# EAGLE design G888X (EAGLE 6.6.0)
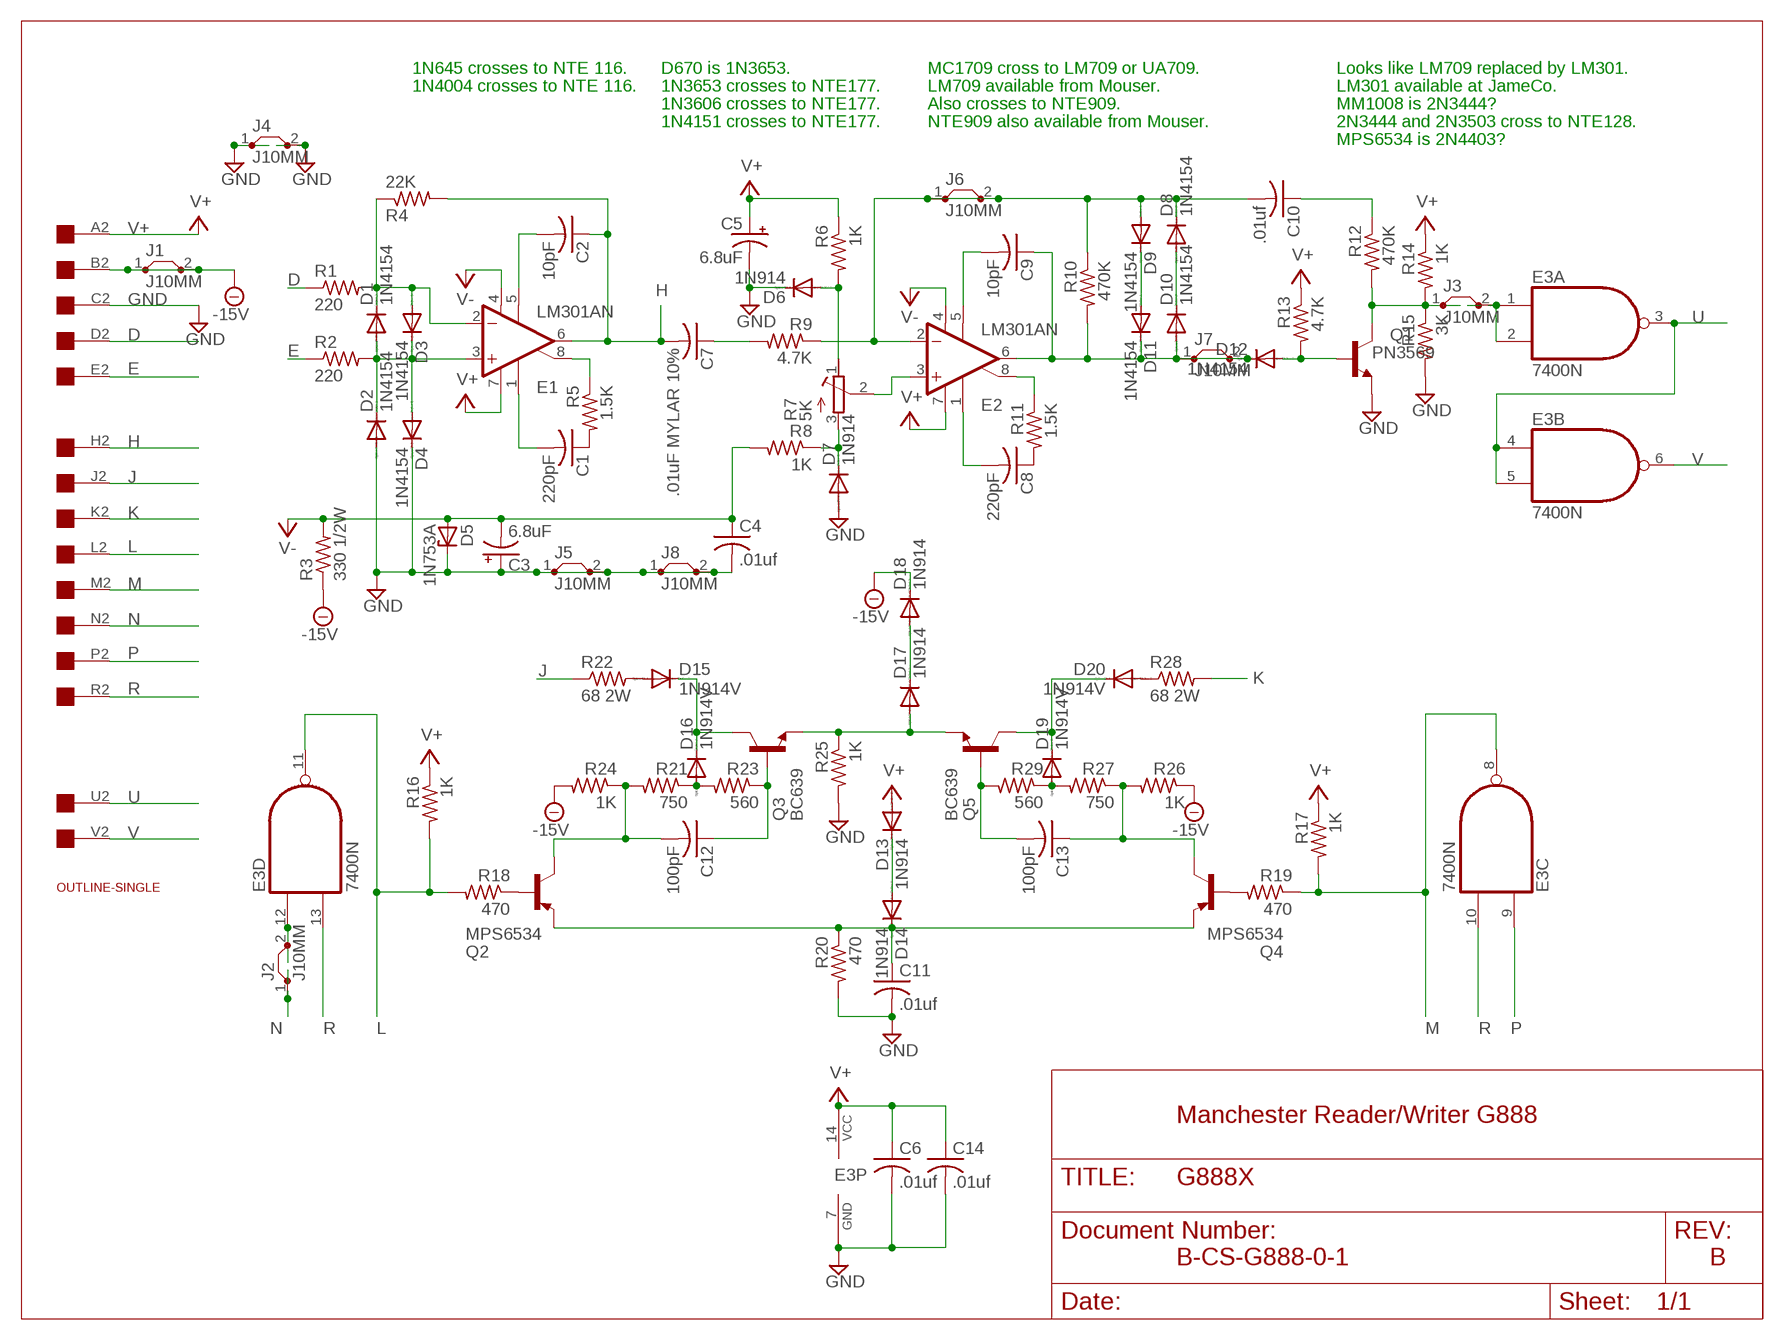
[diagram p0: schematic, sheet 1]

## Parts
C1  220pF  C-US050-025X075  [C050-025X075]
C2  10pF  C-US050-025X075  [C050-025X075]
C3  6.8uF  CPOL-USE20-8AXIAL  [E12-8]
C4  .01uf  C-US050-025X075  [C050-025X075]
C5  6.8uF  CPOL-USE20-8AXIAL  [E12-8]
C6  .01uf  C-US050-025X075  [C050-025X075]
C7  .01uF MYLAR 10%  C-US225-062X268  [C225-062X268]
C8  220pF  C-US050-025X075  [C050-025X075]
C9  10pF  C-US050-025X075  [C050-025X075]
C10  .01uf  C-US050-025X075  [C050-025X075]
C11  .01uf  C-US050-025X075  [C050-025X075]
C12  100pF  C-US050-025X075  [C050-025X075]
C13  100pF  C-US050-025X075  [C050-025X075]
C14  .01uf  C-US050-025X075  [C050-025X075]
D1  1N4154  DIODE-DO35-10  [DO35-10]
D2  1N4154  DIODE-DO35-10  [DO35-10]
D3  1N4154  DIODE-DO35-10  [DO35-10]
D4  1N4154  DIODE-DO35-10  [DO35-10]
D5  1N753A  ZENER-DIODEDO35Z10  [DO35Z10]
D6  1N914  DIODE-DO35-10  [DO35-10]
D7  1N914  DIODE-DO35-10  [DO35-10]
D8  1N4154  DIODE-DO35-10  [DO35-10]
D9  1N4154  DIODE-DO35-10  [DO35-10]
D10  1N4154  DIODE-DO35-10  [DO35-10]
D11  1N4154  DIODE-DO35-10  [DO35-10]
D12  1N4154  DIODE-DO35-10  [DO35-10]
D13  1N914  DIODE-DO35-10  [DO35-10]
D14  1N914  DIODE-DO35-10  [DO35-10]
D15  1N914V  DIODE-DO35-10  [DO35-10]
D16  1N914V  DIODE-DO35-10  [DO35-10]
D17  1N914  DIODE-DO35-10  [DO35-10]
D18  1N914  DIODE-DO35-10  [DO35-10]
D19  1N914V  DIODE-DO35-10  [DO35-10]
D20  1N914V  DIODE-DO35-10  [DO35-10]
E1  LM301AN  MC1709N  [DIL08]
E2  LM301AN  MC1709N  [DIL08]
E3  7400N  [DIL14]
J1  J10MM  [10]
J2  J10MM  [10]
J3  J10MM  [10]
J4  J10MM  [10]
J5  J10MM  [10]
J6  J10MM  [10]
J7  J10MM  [10]
J8  J10MM  [10]
Q1  PN3569  2N1711  [TO39]
Q2  MPS6534  2N5415  [TO39]
Q3  BC639  2N1711  [TO39]
Q4  MPS6534  2N5415  [TO39]
Q5  BC639  2N1711  [TO39]
R1  220  R-US_0207/10  [0207/10]
R2  220  R-US_0207/10  [0207/10]
R3  330 1/2W  R-US_0411/15  [0411/15]
R4  22K  R-US_0207/10  [0207/10]
R5  1.5K  R-US_0207/10  [0207/10]
R6  1K  R-US_0207/10  [0207/10]
R7  5K  275P  [3006Y]
R8  1K  R-US_0207/10  [0207/10]
R9  4.7K  R-US_0207/10  [0207/10]
R10  470K  R-US_0207/10  [0207/10]
R11  1.5K  R-US_0207/10  [0207/10]
R12  470K  R-US_0207/10  [0207/10]
R13  4.7K  R-US_0207/10  [0207/10]
R14  1K  R-US_0207/10  [0207/10]
R15  3K  R-US_0207/10  [0207/10]
R16  1K  R-US_0207/10  [0207/10]
R17  1K  R-US_0207/10  [0207/10]
R18  470  R-US_0207/10  [0207/10]
R19  470  R-US_0207/10  [0207/10]
R20  470  R-US_0207/10  [0207/10]
R21  750  R-US_0207/10  [0207/10]
R22  68 2W  R-US_0817/22  [P0817/22]
R23  560  R-US_0207/10  [0207/10]
R24  1K  R-US_0207/10  [0207/10]
R25  1K  R-US_0207/10  [0207/10]
R26  1K  R-US_0207/10  [0207/10]
R27  750  R-US_0207/10  [0207/10]
R28  68 2W  R-US_0817/22  [P0817/22]
R29  560  R-US_0207/10  [0207/10]
U$1  EDGE-1  [EDGE-CON1]
U$4  OUTLINE-SINGLE  [SINGLE]

## Nets
-15V [Supply]: D18.C J1.1 J1.2 R3.1 R24.2 R26.1 U$1.B2
D: R1.1 U$1.D2
E: R2.1 U$1.E2
GND [Supply]: C3.+ C4.2 C5.- C6.2 C11.2 C14.2 D2.A D4.C D5.C D6.C D7.A E3.7(P:GND) J4.1 J4.2 J5.1 J5.2 J8.1 J8.2 Q1.1(E) R15.2 R20.2 R25.2 U$1.C2
H: C2.1 C7.2 E1.6(OUT) R4.2 U$1.H2
J: R22.1 U$1.J2
K: R28.2 U$1.K2
L: E3.11(D:O) R16.2 R18.2 U$1.L2
M: E3.8(C:O) R17.2 R19.1 U$1.M2
N: E3.12(D:I0) J2.1 J2.2 U$1.N2
N$1: C1.1 R5.2
N$2: C8.1 R11.2
N$3: D1.C D3.A E1.2(-IN) R1.2 R4.1
N$4: D1.A D2.C D3.C D4.A E1.3(+IN) R2.2
N$5: C8.2 E2.1(ON1)
N$6: C1.2 E1.1(ON1)
N$7: E1.8(ON2) R5.1
N$8: C2.2 E1.5(OPT)
N$9: D6.A R6.2 R7.1(A)
N$10: C10.2 D8.C D9.A E2.2(-IN) J6.1 J6.2 R9.1 R10.1
N$11: E2.3(+IN) R7.2(S)
N$12: D7.C R7.3(E) R8.1
N$13: E2.8(ON2) R11.1
N$14: C9.2 E2.5(OPT)
N$15: C9.1 D10.A D11.C D12.C E2.6(OUT) J7.1 J7.2 R10.2
N$16: C7.1 R9.2
N$17: D9.C D11.A
N$18: D8.A D10.C
N$19: C10.1 R12.1
N$20: D12.A Q1.2(B) R13.2
N$21: E3.1(A:I0) E3.2(A:I1) J3.1 J3.2 Q1.3(C) R12.2 R14.2 R15.1
N$22: D17.A Q3.1(E) Q5.1(E) R25.1
N$23: C11.1 D14.C Q2.1(E) Q4.1(E) R20.1
N$24: D13.C D14.A
N$25: Q2.2(B) R18.1
N$26: Q4.2(B) R19.2
N$27: D15.A R22.2
N$28: D16.A R21.1 R23.2
N$29: C12.2 Q2.3(C) R21.2 R24.1
N$30: C12.1 Q3.2(B) R23.1
N$31: D19.A R27.2 R29.1
N$32: C13.1 Q4.3(C) R26.2 R27.1
N$33: C13.2 Q5.2(B) R29.2
N$34: D20.A R28.1
N$35: D15.C D16.C Q3.3(C)
N$36: D19.C D20.C Q5.3(C)
N$37: D17.C D18.A
P: E3.9(C:I0) U$1.P2
R: E3.10(C:I1) E3.13(D:I1) U$1.R2
U: E3.3(A:O) E3.4(B:I0) E3.5(B:I1) U$1.U2
V: E3.6(B:O) U$1.V2
V+ [Supply]: C5.+ C6.1 C14.1 D13.A E1.7(V+) E2.7(V+) E3.14(P:VCC) R6.1 R13.1 R14.1 R16.1 R17.1 U$1.A2
V-: C3.- C4.1 D5.A E1.4(V-) E2.4(V-) R3.2 R8.2
Unconnected: U$1.F2 U$1.S2 U$1.T2

## Notes on the sheet
- 1N645 crosses to NTE 116. | D670 is 1N3653. | MC1709 cross to LM709 or UA709. | Looks like LM709 replaced by LM301.
- 1N4004 crosses to NTE 116. | 1N3653 crosses to NTE177. | LM709 available from Mouser. | LM301 available at JameCo.
- 1N3606 crosses to NTE177. | Also crosses to NTE909. | MM1008 is 2N3444?
- 1N4151 crosses to NTE177. | NTE909 also available from Mouser. | 2N3444 and 2N3503 cross to NTE128.
- MPS6534 is 2N4403?
- Manchester Reader/Writer G888
- B-CS-G888-0-1 | B

## Library data of the parts
C1 C2 C4 C6-C14 = rcl:C-US: CAPACITOR, American symbol
C3 C5 = dec-con:CPOL-USE20-8AXIAL: A 0.8 inch electrolytic.
D1-D4 D6-D20 = diode:DIODE-: DIODE
D5 = diode:ZENER-DIODE: Z-Diode
E1 E2 = dec-con:MC1709: OP AMP
E3 = 74xx-us:74*00: Quad 2-input NAND gate
J1-J8 = jumper:J: Bridge
Q1 Q3 Q5 = transistor-npn:2N1711: NPN Transistor
Q2 Q4 = transistor-pnp:2N5415*: PNP Transistror
R1-R6 R8-R29 = rcl:R-US_: RESISTOR, American symbol
R7 = dec-con:275P: Trimpot with 275P (3006Y) footprint.
U$1 = dec-con:EDGE-1: Single-Sided DEC Edge Connector -- (side 2)
U$4 = dec-con:OUTLINE-*: Board outlines for DEC boards.

## Net classes
1 Supply: width 0.813 mm

## Board
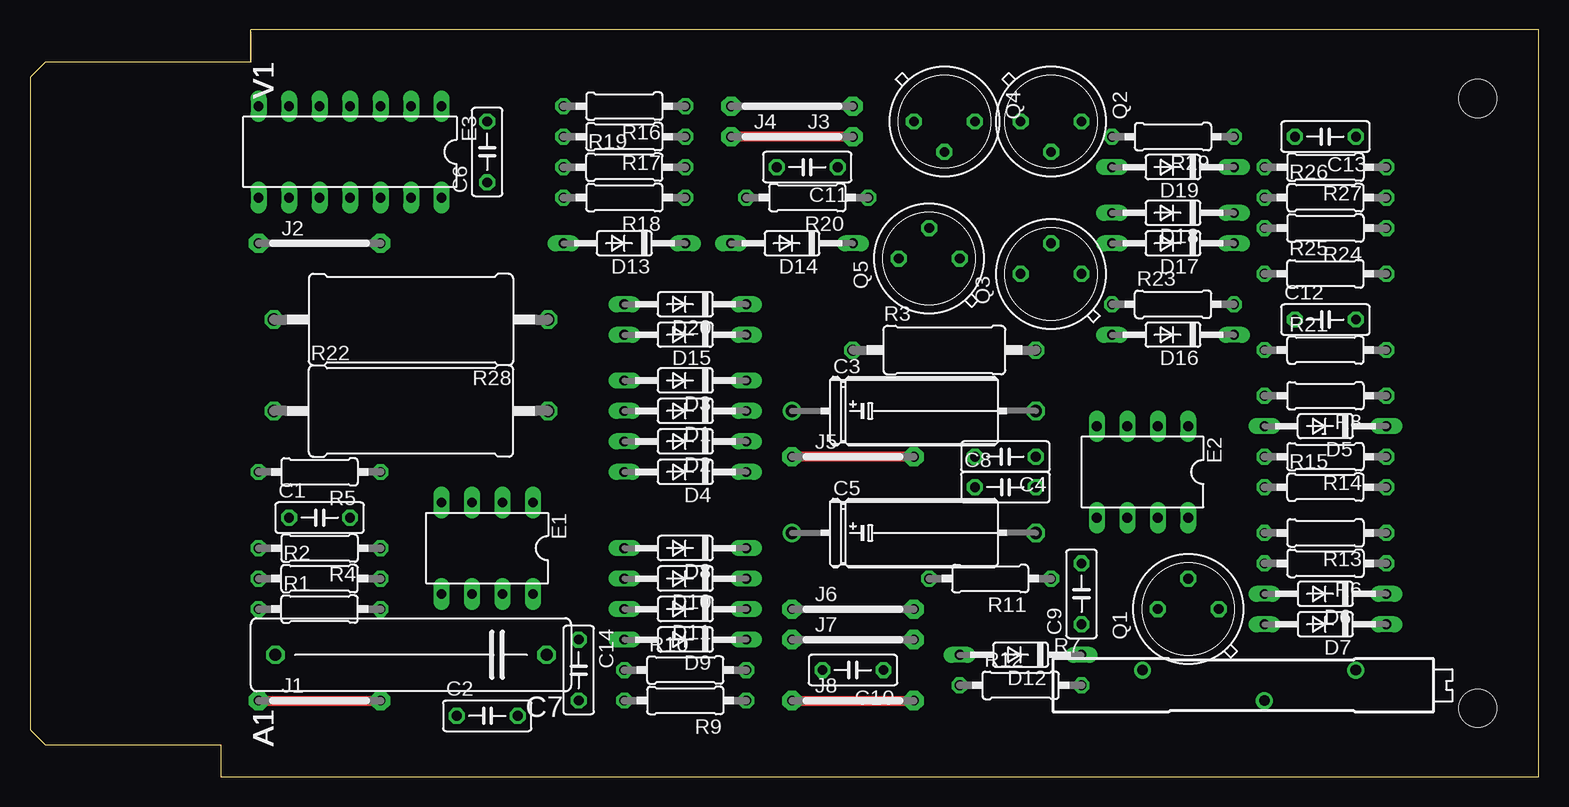
[diagram p1: board, top side]
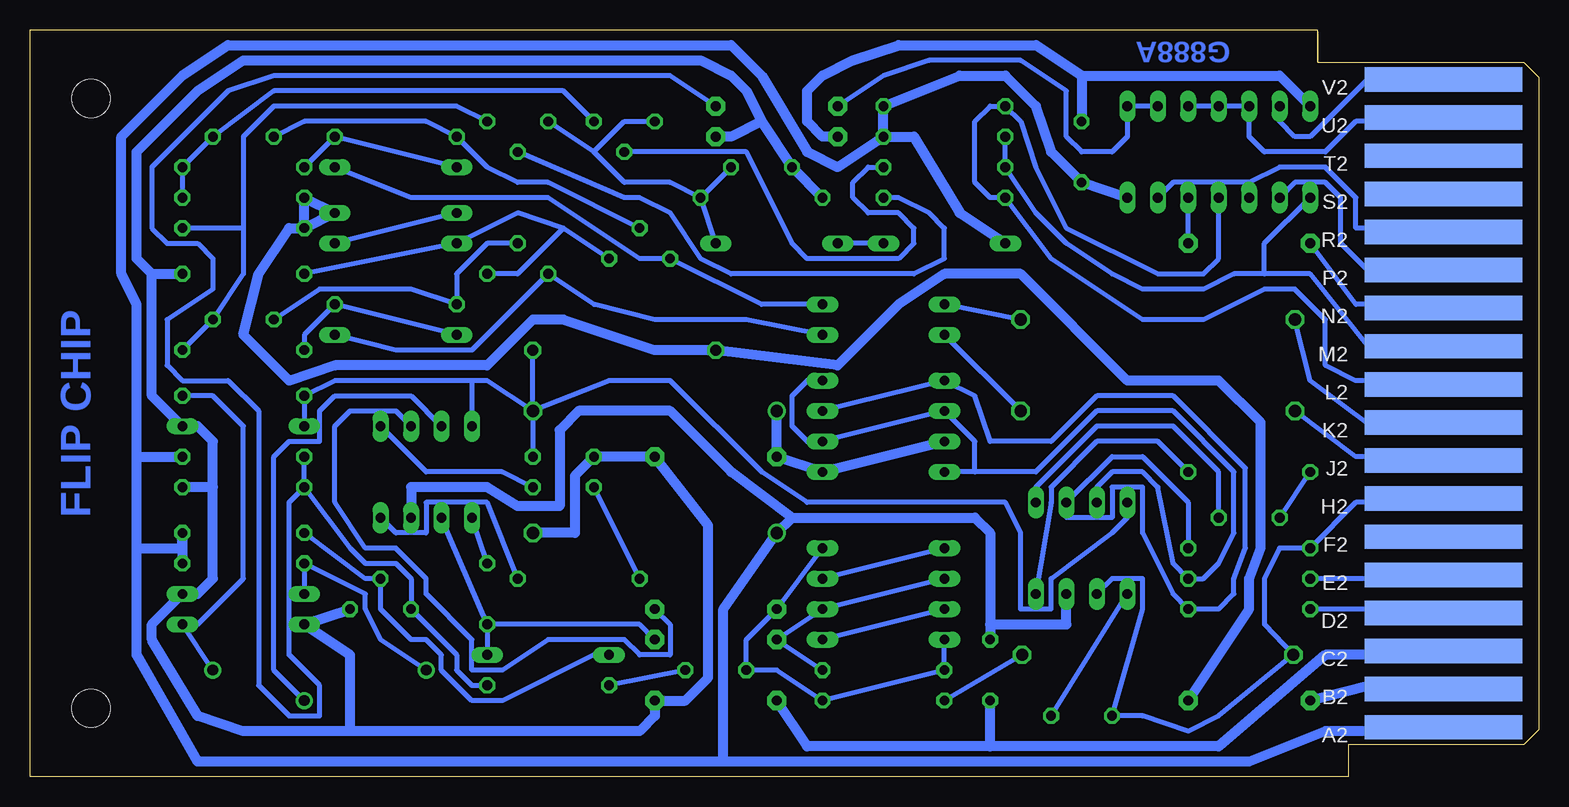
[diagram p2: board, bottom side, seen from below]

Size 125.73 x 62.23 mm. Coordinates in mm from the lower left corner, seen from the top.
Copper layers (1+16): Top 0.035mm / dielectric 1.5mm / Bottom 0.035mm
Design rules "16mils": minimum track width 16mil, minimum drill 32mil, track to track 15mil, track to pad 10mil, pad to pad 10mil, via to via 10mil, smd to smd 10mil, copper to edge 13mil, drill to drill 10mil, minimum pad ring 10mil, minimum via ring 8mil, stop-mask expansion 0mil, vias tented up to drill 0mil, thermal gap 10mil

### Footprints (pad centres in the part's own frame; a part is rotated, then mirrored left to right if it is on the bottom)
C050-025X075 = drill 0.813 octagon: 1 -2.54,0; 2 2.54,0
E12-8 = drill 1.016: + -10.16,0 | drill 1.016 octagon: - 10.16,0
C225-062X268 = drill 1.016 octagon: 1 -11.303,0; 2 11.303,0
DO35-10 = drill 0.813 long: A 5.08,0; C -5.08,0
DO35Z10 = drill 0.813 long: A 5.08,0; C -5.08,0
DIL08 = drill 0.813 long: 1 -3.81,-3.81; 2 -1.27,-3.81; 3 1.27,-3.81; 4 3.81,-3.81; 5 3.81,3.81; 6 1.27,3.81; 7 -1.27,3.81; 8 -3.81,3.81
DIL14 = drill 0.813 long: 1 -7.62,-3.81; 2 -5.08,-3.81; 3 -2.54,-3.81; 4 0,-3.81; 5 2.54,-3.81; 6 5.08,-3.81; 7 7.62,-3.81; 8 7.62,3.81; 9 5.08,3.81; 10 2.54,3.81; 11 0,3.81; 12 -2.54,3.81; 13 -5.08,3.81; 14 -7.62,3.81
10 = drill 0.813 pad 1.6 octagon: 1 -5.08,0; 2 5.08,0
TO39 = drill 0.813 octagon: 1 0,-2.54; 2 2.54,0; 3 0,2.54
0207/10 = drill 0.813 octagon: 1 -5.08,0; 2 5.08,0
0411/15 = drill 0.914 octagon: 1 -7.62,0; 2 7.62,0
3006Y = drill 0.9: 1 -8.89,1.27; 2 1.27,-1.27; 3 8.89,1.27
P0817/22 = drill 1.016 octagon: 1 -11.43,0; 2 11.43,0
EDGE-CON1 = smd 13.106 x 2.032 bottom: A2 7.938,4.128; B2 7.938,7.303; C2 7.938,10.477; D2 7.938,13.652; E2 7.938,16.828; F2 7.938,20.003; H2 7.938,23.177; J2 7.938,26.352; K2 7.938,29.527; L2 7.938,32.703; M2 7.938,35.877; N2 7.938,39.053; P2 7.938,42.227; R2 7.938,45.403; S2 7.938,48.578; T2 7.938,51.752; U2 7.938,54.928; V2 7.938,58.102
SINGLE = hole 3.175: 120.65,56.515; 120.65,5.715

### Placement (x,y rotation side)
C1  24.13,21.59 0 top
C2  38.1,5.08 0 top
C3  73.66,30.48 0 top
C4  81.28,26.67 180 top
C5  73.66,20.32 0 top
C6  38.1,52.07 90 top
C7  31.75,10.16 180 top
C8  81.28,24.13 0 top
C9  87.63,15.24 90 top
C10  68.58,8.89 180 top
C11  64.77,50.8 180 top
C12  107.95,38.1 0 top
C13  107.95,53.34 180 top
C14  45.72,8.89 270 top
D1  54.61,30.48 180 top
D2  54.61,27.94 180 top
D3  54.61,33.02 180 top
D4  54.61,25.4 180 top
D5  107.95,29.21 180 top
D6  107.95,15.24 180 top
D7  107.95,12.7 180 top
D8  54.61,19.05 180 top
D9  54.61,11.43 180 top
D10  54.61,16.51 180 top
D11  54.61,13.97 180 top
D12  82.55,10.16 180 top
D13  49.53,44.45 180 top
D14  63.5,44.45 180 top
D15  54.61,36.83 180 top
D16  95.25,36.83 180 top
D17  95.25,44.45 180 top
D18  95.25,46.99 180 top
D19  95.25,50.8 180 top
D20  54.61,39.37 180 top
E1  38.1,19.05 180 top
E2  92.71,25.4 180 top
E3  26.67,52.07 180 top
J1  24.13,6.35 0 top
J2  24.13,44.45 0 top
J3  63.5,55.88 180 top
J4  63.5,53.34 0 top
J5  68.58,26.67 0 top
J6  68.58,13.97 0 top
J7  68.58,11.43 0 top
J8  68.58,6.35 0 top
Q1  96.52,13.97 90 top
Q2  85.09,54.61 270 top
Q3  85.09,41.91 90 top
Q4  76.2,54.61 270 top
Q5  74.93,43.18 90 top
R1  24.13,13.97 0 top
R2  24.13,16.51 0 top
R3  76.2,35.56 0 top
R4  24.13,19.05 180 top
R5  24.13,25.4 180 top
R6  107.95,17.78 180 top
R7  101.6,7.62 0 top
R8  107.95,31.75 180 top
R9  54.61,6.35 180 top
R10  54.61,8.89 0 top
R11  80.01,16.51 180 top
R12  82.55,7.62 0 top
R13  107.95,20.32 180 top
R14  107.95,26.67 180 top
R15  107.95,24.13 0 top
R16  49.53,55.88 180 top
R17  49.53,53.34 180 top
R18  49.53,48.26 180 top
R19  49.53,50.8 0 top
R20  64.77,48.26 180 top
R21  107.95,35.56 0 top
R22  31.75,30.48 0 top
R23  95.25,39.37 0 top
R24  107.95,45.72 180 top
R25  107.95,41.91 0 top
R26  107.95,48.26 0 top
R27  107.95,50.8 180 top
R28  31.75,38.1 180 top
R29  95.25,53.34 180 top
U$1  0,0 0 top
U$4  0,0 0 top

### Tracks (layer width: path | path; a pad name or v marks a point on that pad's centre or on a via)
-15V
  Top 0.813: J1.1 J1.2
  Bottom 0.813: R24.2 R26.1 D18.C R24.2 | R24.2 104.14,45.72 106.68,41.91 107.95,36.83 104.14,33.02 100.33,34.29 87.63,34.29 83.82,38.1 81.28,38.1 73.66,35.56 R3.1 58.42,34.29 53.34,39.37 49.53,41.91 43.18,41.91 34.29,33.02 26.67,33.02 23.18,29.53 23.18,19.05 24.13,16.51 24.13,13.97 J1.2 | U$1.B2 8.89,7.62 13.97,7.62 J1.1
D
  Bottom 0.406: U$1.D2 8.89,13.97 R1.1
E
  Bottom 0.406: U$1.E2 8.89,16.51 R2.1
GND
  Top 0.813: J4.2 J4.1 | J5.2 J5.1 | J8.1 J8.2
  Bottom 0.813: U$1.C2 8.89,10.16 17.78,10.16 26.67,2.54 45.72,2.54 | 45.72,2.54 60.96,2.54 J8.1 | 99.06,3.81 74.93,3.81 73.66,5.08 J8.2 71.12,6.35 69.22,8.26 69.22,20.95 J5.2 C4.2 80.33,25.08 80.33,20.32 C5.- | 99.06,3.81 107.95,3.81 111.76,5.08 115.57,11.43 115.57,12.7 D6.C 111.76,15.24 110.49,16.51 110.49,24.13 | D2.A D4.C J5.1 C3.+ | E3.7 21.59,58.42 38.1,58.42 | 38.1,58.42 C6.2 | 38.1,58.42 41.91,60.96 53.34,60.96 57.15,59.69 59.69,58.42 60.96,57.15 60.96,54.61 59.69,53.34 J4.1 | R20.2 C11.2 64.77,54.61 | 64.77,54.61 67.31,53.34 J4.2 | 64.77,54.61 66.04,57.15 67.31,58.42 69.85,59.69 107.95,59.69 111.76,57.15 116.84,52.07 116.84,43.18 115.57,41.91 | 45.72,2.54 C14.2 | 110.49,24.13 R15.2 | 110.49,24.13 110.49,27.94 111.76,29.21 D5.C 115.57,31.75 115.57,41.91 | 115.57,41.91 R25.2 | Q1.1 D7.A 99.06,10.16 99.06,3.81
H
  Bottom 0.406: U$1.H2 8.89,22.86 15.24,22.86 R4.2 21.59,19.05 22.86,16.51 22.86,12.7 C7.2 26.67,5.08 29.21,3.81 33.02,5.08 C2.1 33.02,13.97 33.02,16.51 35.56,16.51 E1.6
J
  Bottom 0.406: U$1.J2 8.89,26.67 15.24,26.67 R22.1
K
  Bottom 0.406: U$1.K2 8.89,29.21 13.97,29.21 19.05,33.02 R28.2
L
  Bottom 0.406: E3.11 26.67,43.18 27.94,41.91 31.75,41.91 39.37,45.72 41.91,50.8 43.18,54.61 R16.2 45.72,55.88 46.99,54.61 46.99,49.53 45.72,48.26 R18.2 40.64,43.18 33.02,38.1 27.94,38.1 22.86,40.64 20.32,40.64 17.78,38.1 17.78,34.29 15.24,33.02 8.89,33.02 U$1.L2
M
  Bottom 0.406: U$1.M2 8.89,35.56 13.97,35.56 19.05,41.91 22.86,41.91 | 22.86,41.91 22.86,44.45 E3.8 | R17.2 R19.1 41.91,46.99 39.37,44.45 35.56,41.91 33.02,40.64 27.94,40.64 25.4,41.91 22.86,41.91
N
  Top 0.406: J2.1 J2.2
  Bottom 0.406: U$1.N2 8.89,39.37 15.24,39.37 J2.1 | J2.2 E3.12
N$1
  Bottom 0.406: C1.1 R5.2
N$2
  Bottom 0.406: R11.2 C8.1
N$3
  Bottom 0.406: D1.C D3.A 46.99,31.75 45.72,27.94 40.64,27.94 36.83,31.75 30.48,31.75 24.45,25.72 24.45,19.05 25.4,16.51 25.4,15.24 26.67,13.97 R1.2 30.48,15.24 33.02,20.32 33.02,24.13 35.56,24.13 35.56,21.59 39.37,21.59 E1.2 35.56,26.67 33.02,26.67 29.21,22.86 R4.1
N$4
  Bottom 0.406: D3.C 60.96,33.02 62.23,31.75 62.23,29.21 60.96,27.94 D2.C D1.A 46.99,27.94 46.99,25.4 | 46.99,25.4 D4.A | E1.3 36.83,24.13 35.56,25.4 33.02,25.4 31.75,24.13 30.48,17.78 R2.2 27.94,16.51 26.67,17.78 25.4,20.32 25.4,25.4 30.48,30.48 36.83,30.48 41.91,25.4 46.99,25.4
N$5
  Bottom 0.406: C8.2 86.36,25.4 92.71,25.4 E2.1
N$6
  Bottom 0.406: C1.2 26.67,25.4 30.48,29.21 36.83,29.21 41.91,24.13 E1.1
N$7
  Bottom 0.406: R5.1 31.75,27.94 36.83,27.94 40.64,24.13 40.64,22.86 E1.8
N$8
  Bottom 0.406: C2.2 E1.5
N$9
  Bottom 0.406: R7.1 96.52,11.43 97.79,13.97 97.79,15.24 R6.2 D6.A
N$10
  Top 0.406: J6.1 J6.2
  Bottom 0.406: D8.C J6.1 66.04,11.43 C10.2 63.5,8.89 R9.1 R10.1 D9.A | E2.2 95.25,30.48 99.06,30.48 100.33,29.21 100.33,22.86 97.79,19.05 95.25,19.05 92.71,16.51 92.71,15.24 88.9,11.43 88.9,8.89 86.36,8.89 82.55,11.43 76.2,11.43 74.93,10.16 72.39,10.16 72.39,12.7 J6.2
N$11
  Bottom 0.406: R7.2 105.41,8.89 105.41,26.67 104.14,27.94 101.6,27.94 101.6,30.48 100.33,31.75 93.98,31.75 E2.3
N$12
  Bottom 0.406: R7.3 D7.C 111.76,12.7 107.95,16.51 107.95,29.21 110.49,31.75 R8.1
N$13
  Bottom 0.406: R11.1 87.63,22.86 92.71,22.86 92.71,20.32 95.25,20.32 E2.8
N$14
  Bottom 0.406: C9.2 E2.5
N$15
  Top 0.406: J7.1 J7.2
  Bottom 0.406: R10.2 J7.1 D11.C D10.A | C9.1 D12.C C9.1 | C9.1 E2.6 | J7.2 74.93,12.7 C9.1
N$16
  Bottom 0.406: C7.1 R9.2
N$17
  Bottom 0.406: D11.A D9.C
N$18
  Bottom 0.406: D8.A D10.C
N$19
  Bottom 0.406: C10.1 R12.1
N$20
  Bottom 0.406: R13.2 97.79,16.51 Q1.2 96.52,13.97 93.98,11.43 92.71,11.43 91.44,10.16 91.44,8.89 88.9,6.35 86.36,6.35 78.74,10.16 D12.A
N$21
  Top 0.406: J3.2 J3.1
  Bottom 0.406: R12.2 88.9,7.62 90.17,8.89 90.17,10.16 Q1.3 93.98,16.51 95.25,17.78 97.79,17.78 99.06,19.05 R15.1 | R15.1 R14.2 R15.1 | J3.1 72.39,58.42 105.41,58.42 109.22,57.15 115.57,50.8 115.57,45.72 114.3,44.45 111.76,44.45 110.49,43.18 110.49,40.64 114.3,38.1 114.3,34.29 113.03,33.02 109.22,33.02 106.68,30.48 106.68,7.62 104.14,5.08 101.6,5.08 101.6,7.62 104.14,10.16 104.14,22.86 R15.1 | E3.2 E3.1 34.29,53.34 35.56,52.07 38.1,52.07 39.37,53.34 39.37,57.15 43.18,59.69 50.8,59.69 54.61,58.42 J3.2
N$22
  Bottom 0.406: R25.1 D17.A 85.09,46.99 81.28,45.72 | Q3.1 85.09,41.91 81.28,45.72 | Q5.1 81.28,45.72
N$23
  Bottom 0.406: R20.1 C11.1 | D14.C R20.1 | Q4.1 76.2,54.61 78.74,52.07 | 78.74,52.07 Q2.1 | 78.74,52.07 76.2,49.53 72.39,49.53 R20.1
N$24
  Bottom 0.406: D13.C D14.A
N$25
  Bottom 0.406: R18.1 53.34,48.26 50.8,46.99 49.53,45.72 49.53,43.18 52.07,41.91 67.31,41.91 69.85,43.18 72.39,46.99 74.93,48.26 76.2,48.26 Q2.2
N$26
  Bottom 0.406: Q4.2 66.04,52.07 62.23,44.45 60.96,43.18 53.34,43.18 52.07,44.45 52.07,45.72 53.34,46.99 55.88,46.99 57.15,48.26 57.15,49.53 55.88,50.8 R19.2
N$27
  Bottom 0.406: R22.2 D15.A
N$28
  Bottom 0.406: D16.A R23.2 102.87,36.83 R21.1
N$29
  Bottom 0.406: Q2.3 90.17,55.88 105.41,55.88 107.95,53.34 107.95,45.72 | 107.95,45.72 R24.1 | 107.95,45.72 107.95,41.91 C12.2 R21.2
N$30
  Bottom 0.406: C12.1 101.6,40.64 93.98,40.64 R23.1 90.17,41.91 87.63,44.45 Q3.2
N$31
  Bottom 0.406: D19.A R29.1 R27.2
N$32
  Bottom 0.406: Q4.3 81.28,57.15 105.41,57.15 C13.1 R27.1 R26.2
N$33
  Bottom 0.406: Q5.2 82.55,49.53 85.09,49.53 87.63,50.8 R29.2 92.71,54.61 102.87,54.61 C13.2
N$34
  Bottom 0.406: R28.1 D20.A
N$35
  Bottom 0.406: D15.C 66.04,38.1 73.66,38.1 78.74,39.37 Q3.3 88.9,35.56 95.25,35.56 D16.C
N$36
  Bottom 0.406: D20.C 64.77,39.37 Q5.3 74.93,43.18 82.55,48.26 93.98,48.26 D19.C
N$37
  Bottom 0.406: D18.A D17.C
P
  Bottom 0.406: E3.9 20.32,49.53 17.78,49.53 16.51,48.26 16.51,44.45 13.97,41.91 8.89,41.91 U$1.P2
R
  Bottom 0.406: E3.13 30.48,49.53 24.13,49.53 | U$1.R2 8.89,45.72 15.24,45.72 15.24,48.26 17.78,50.8 21.59,50.8 24.13,49.53 | 24.13,49.53 E3.10
U
  Bottom 0.406: U$1.U2 8.89,54.61 15.24,54.61 17.78,52.07 22.86,52.07 24.13,53.34 E3.5 E3.4 E3.3
V
  Bottom 0.406: U$1.V2 8.89,58.42 13.97,58.42 19.05,53.34 20.32,53.34 21.59,54.61 E3.6
V+
  Bottom 0.813: U$1.A2 8.89,3.81 17.78,3.81 24.13,1.27 67.95,1.27 | R17.1 R16.1 48.26,58.42 44.45,58.42 41.91,55.88 40.64,52.07 C6.1 E3.14 | R17.1 58.42,50.8 60.96,52.07 64.77,58.42 67.31,60.96 109.22,60.96 113.03,58.42 118.11,53.34 118.11,41.91 116.84,39.37 116.84,26.67 | 45.72,20.32 C14.1 | E2.7 93.98,24.13 87.63,24.13 85.09,22.54 81.6,22.54 81.6,28.89 80.01,30.48 72.39,30.48 67.31,25.4 62.23,21.59 | 62.23,21.59 C5.+ 67.95,13.97 67.95,1.27 | 45.72,20.32 46.99,21.59 62.23,21.59 | 45.72,20.32 45.72,12.7 39.37,12.7 E1.7 | D13.A 48.26,46.99 52.07,53.34 R17.1 | 67.95,1.27 111.76,1.27 116.84,10.16 116.84,19.05 | 116.84,19.05 116.84,26.67 | 116.84,26.67 R14.1 | R6.1 R13.1 113.03,19.05 116.84,19.05
V-
  Bottom 0.406: E1.4 34.29,21.59 35.56,20.32 40.64,16.51 40.64,13.97 43.18,13.97 43.18,20.32 44.45,22.86 60.96,22.86 64.77,25.4 72.39,33.02 77.47,33.02 C3.- | 88.9,33.02 87.63,33.02 C3.- | R8.2 D5.A R8.2 | C3.- R3.2 | C3.- C4.1 | R8.2 100.33,33.02 99.06,33.02 88.9,33.02 | 88.9,33.02 E2.4

### Text on the board
Bottom: G888A | FLIP CHIP
tNames: V1 | V1 | V1 | V1 | V1 | V1 | V1 | V1 | V1 | V1 | V1 | V1 | V1 | V1 | V1 | V1 | V1 | V1 | V1 | V1 | V1 | V1 | V1 | V1 | V1 | V1 | V1 | V1 | V1 | V1 | V1 | V1 | A1 | A1 | A1 | A1 | A1 | A1 | A1 | A1 | A1 | A1 | A1 | A1 | A1 | A1 | A1 | A1 | A1 | A1 | A1 | A1 | A1 | A1 | A1 | A1 | A1 | A1 | A1 | A1 | A1 | A1 | A1 | A1